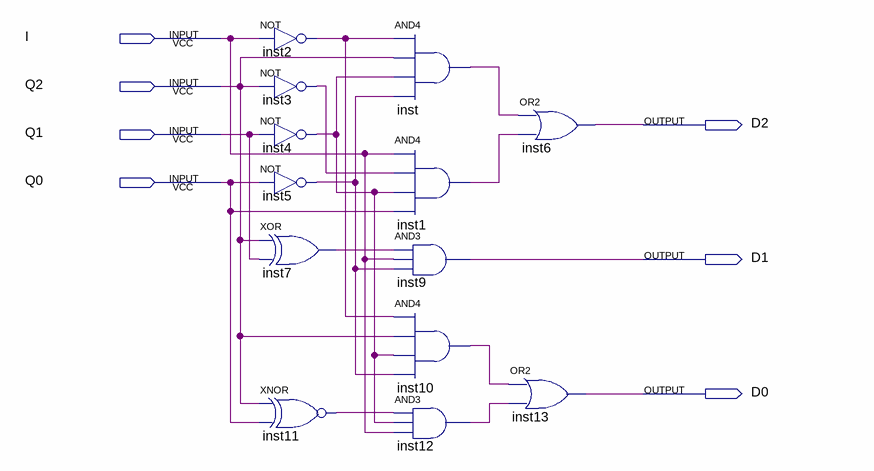
[diagram p0: schematic sheet]
// Quartus schematic NEXTSTATE.bdf as structural Verilog: 13 symbols, 7 pins
module NEXTSTATE (
  input  I,
  input  Q2,
  input  Q1,
  input  Q0,
  output D2,
  output D1,
  output D0
);

  wire inst1_out, inst2_out, inst3_out, inst4_out, inst5_out, inst7_out, inst10_out, inst11_out, inst12_out,
       inst_out;

  not inst2 (inst2_out, I);
  not inst3 (inst3_out, Q2);
  not inst4 (inst4_out, Q1);
  not inst5 (inst5_out, Q0);
  xor inst7 (inst7_out, Q2, Q1);
  xnor inst11 (inst11_out, Q2, Q0);
  and inst (inst_out, inst2_out, Q2, inst4_out, inst5_out);
  and inst1 (inst1_out, I, inst3_out, inst4_out, Q0);
  and inst9 (D1, inst7_out, I, inst5_out);
  and inst10 (inst10_out, inst2_out, Q2, inst4_out, inst5_out);
  and inst12 (inst12_out, inst11_out, inst4_out, I);
  or inst6 (D2, inst_out, inst1_out);
  or inst13 (D0, inst10_out, inst12_out);
endmodule
